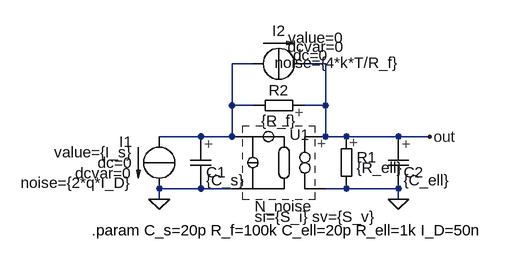
[diagram p0: schematic transimpedanceNoise.asc]
transimpedanceNoise.asc, the LTspice schematic file:
Version 4
SHEET 1 880 680
WIRE 176 0 144 0
WIRE 288 0 256 0
WIRE 144 64 144 0
WIRE 176 64 144 64
WIRE 288 64 288 0
WIRE 288 64 256 64
WIRE 96 112 32 112
WIRE 144 112 144 64
WIRE 144 112 96 112
WIRE 288 112 288 64
WIRE 320 112 288 112
WIRE 400 112 320 112
WIRE 448 112 400 112
WIRE 96 192 32 192
WIRE 144 192 96 192
WIRE 320 192 288 192
WIRE 400 192 320 192
WIRE 32 208 32 192
WIRE 400 208 400 192
FLAG 32 208 0
FLAG 448 112 out
FLAG 400 208 0
SYMBOL SLC 96 112 R0
SYMATTR InstName C1
SYMATTR Value {C_s}
SYMBOL SLI 32 112 M0
SYMATTR InstName I1
SYMATTR Value value={I_s}
SYMATTR SpiceLine2 noise={2*q*I_D}
SYMBOL SLR 320 112 R0
SYMATTR InstName R1
SYMATTR Value {R_ell}
SYMBOL SLC 400 112 R0
SYMATTR InstName C2
SYMATTR Value {C_ell}
SYMBOL SLR 256 64 R90
WINDOW 0 -8 40 VBottom 2
WINDOW 3 8 40 VTop 2
SYMATTR InstName R2
SYMATTR Value {R_f}
SYMBOL SLN_noise 224 96 R0
WINDOW 0 9 13 Left 2
WINDOW 38 -45 123 Left 2
WINDOW 3 -45 139 Left 2
SYMATTR InstName U1
SYMBOL SLI 176 0 R270
WINDOW 0 35 40 VTop 2
WINDOW 3 56 97 VBottom 2
WINDOW 123 29 89 VBottom 2
WINDOW 39 42 97 VBottom 2
WINDOW 40 17 129 VBottom 2
SYMATTR InstName I2
SYMATTR SpiceLine2 noise={4*k*T/R_f}
TEXT -72 256 Left 2 !.param C_s=20p R_f=100k C_ell=20p R_ell=1k I_D=50n

The netlist it stands for:
* transimpedanceNoise.asc
C1 N001 0 {C_s}
I1 N001 0 I value={I_s} dc=0 dcvar=0 noise={2*q*I_D}
R1 out 0 {R_ell}
C2 out 0 {C_ell}
R2 out N001 {R_f}
XU1 N001 0 out 0 N_noise si={S_i} sv={S_v}  ; pins NC+ NC- + -
I2 N001 out I value=0 dc=0 dcvar=0 noise={4*k*T/R_f}
.param C_s=20p R_f=100k C_ell=20p R_ell=1k I_D=50n
.lib SLiCAP.lib
.backanno
.end